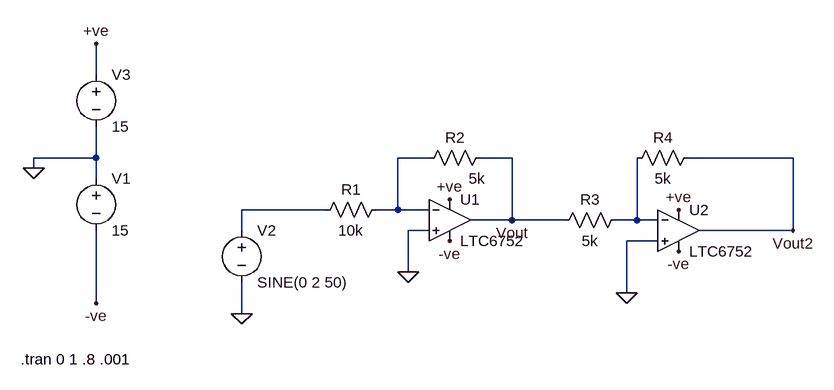
[diagram p0: schematic AmplifierOpamp.asc]
AmplifierOpamp.asc, the LTspice schematic file:
Version 4
SHEET 1 880 680
WIRE -288 -80 -288 -128
WIRE -288 48 -288 0
WIRE -288 48 -384 48
WIRE 224 48 176 48
WIRE 352 48 304 48
WIRE 784 48 624 48
WIRE -384 64 -384 48
WIRE -288 80 -288 48
WIRE 64 128 -64 128
WIRE 176 128 176 48
WIRE 176 128 144 128
WIRE 224 128 176 128
WIRE 352 144 352 48
WIRE 352 144 288 144
WIRE 432 144 352 144
WIRE 544 144 544 48
WIRE 544 144 512 144
WIRE 576 144 544 144
WIRE -64 160 -64 128
WIRE 224 160 192 160
WIRE 784 160 784 48
WIRE 784 160 640 160
WIRE 576 176 528 176
WIRE 192 224 192 160
WIRE 528 256 528 176
WIRE -288 272 -288 160
WIRE -64 288 -64 240
FLAG -384 64 0
FLAG -288 -128 +ve
FLAG -288 272 -ve
FLAG 256 112 +ve
FLAG 256 176 -ve
FLAG -64 288 0
FLAG 192 224 0
FLAG 352 144 Vout
FLAG 528 256 0
FLAG 784 160 Vout2
FLAG 608 128 +ve
FLAG 608 192 -ve
SYMBOL res 160 112 R90
WINDOW 0 0 56 VBottom 2
WINDOW 3 32 56 VTop 2
SYMATTR InstName R1
SYMATTR Value 10k
SYMBOL res 320 32 R90
WINDOW 0 0 56 VBottom 2
WINDOW 3 32 22 VTop 2
SYMATTR InstName R2
SYMATTR Value 5k
SYMBOL Comparators\\LTC6752 256 80 R0
SYMATTR InstName U1
SYMBOL voltage -288 64 R0
WINDOW 123 0 0 Left 0
WINDOW 39 0 0 Left 0
SYMATTR InstName V1
SYMATTR Value 15
SYMBOL voltage -64 144 R0
WINDOW 123 0 0 Left 0
WINDOW 39 0 0 Left 0
SYMATTR InstName V2
SYMATTR Value SINE(0 2 50)
SYMBOL voltage -288 -96 R0
WINDOW 123 0 0 Left 0
WINDOW 39 0 0 Left 0
SYMATTR InstName V3
SYMATTR Value 15
SYMBOL Comparators\\LTC6752 608 96 R0
SYMATTR InstName U2
SYMBOL res 528 128 R90
WINDOW 0 0 56 VBottom 2
WINDOW 3 32 56 VTop 2
SYMATTR InstName R3
SYMATTR Value 5k
SYMBOL res 640 32 R90
WINDOW 0 0 56 VBottom 2
WINDOW 3 32 56 VTop 2
SYMATTR InstName R4
SYMATTR Value 5k
TEXT -404 358 Left 2 !.tran 0 1 .8 .001

The netlist it stands for:
* AmplifierOpamp.asc
R1 N001 N002 10k
R2 Vout N001 5k
XU1 0 N001 +ve -ve Vout LTC6752  ; pins In+ In- V+ V- OUT
V1 0 -ve 15
V2 N002 0 SINE(0 2 50)
V3 +ve 0 15
XU2 0 N003 +ve -ve Vout2 LTC6752  ; pins In+ In- V+ V- OUT
R3 N003 Vout 5k
R4 Vout2 N003 5k
.tran 0 1 .8 .001
.lib LTC7.lib
.backanno
.end